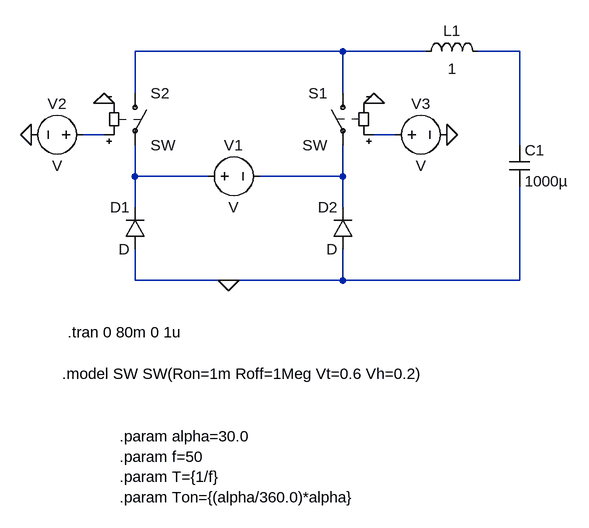
[diagram p0: schematic Draft2.asc]
Draft2.asc, the LTspice schematic file:
Version 4.1
SHEET 1 880 772
WIRE 176 64 -144 64
WIRE 304 64 176 64
WIRE 448 64 384 64
WIRE -144 128 -144 64
WIRE 176 128 176 64
WIRE -192 192 -224 192
WIRE 256 192 224 192
WIRE 448 208 448 64
WIRE -144 256 -144 208
WIRE -32 256 -144 256
WIRE 176 256 176 208
WIRE 176 256 48 256
WIRE -144 304 -144 256
WIRE 176 304 176 256
WIRE -144 416 -144 368
WIRE 0 416 -144 416
WIRE 176 416 176 368
WIRE 176 416 0 416
WIRE 448 416 448 272
WIRE 448 416 176 416
FLAG 0 416 0
FLAG -192 144 0
FLAG 224 144 0
FLAG 336 192 0
FLAG -304 192 0
SYMBOL sw 176 112 M0
SYMATTR InstName S1
SYMBOL sw -144 112 R0
SYMATTR InstName S2
SYMBOL diode -128 368 R180
WINDOW 0 24 64 Left 2
WINDOW 3 24 0 Left 2
SYMATTR InstName D1
SYMBOL diode 192 368 R180
WINDOW 0 24 64 Left 2
WINDOW 3 24 0 Left 2
SYMATTR InstName D2
SYMBOL voltage -48 256 R270
WINDOW 0 32 56 VTop 2
WINDOW 3 -32 56 VBottom 2
SYMATTR InstName V1
SYMBOL ind 400 80 M270
WINDOW 0 32 56 VTop 2
WINDOW 3 5 56 VBottom 2
SYMATTR InstName L1
SYMATTR Value 1
SYMATTR SpiceLine Rser=1m
SYMBOL cap 432 208 R0
SYMATTR InstName C1
SYMATTR Value 1000µ
SYMBOL voltage -208 192 R90
WINDOW 0 -32 56 VBottom 2
WINDOW 3 32 56 VTop 2
SYMATTR InstName V2
SYMBOL voltage 240 192 R270
WINDOW 0 32 56 VTop 2
WINDOW 3 -32 56 VBottom 2
SYMATTR InstName V3
TEXT -256 560 Left 2 !.model SW SW(Ron=1m Roff=1Meg Vt=0.6 Vh=0.2)
TEXT -248 496 Left 2 !.tran 0 80m 0 1u
TEXT -168 656 Left 2 !.param alpha=30.0\n.param f=50\n.param T={1/f}\n.param Ton={(alpha/360.0)*alpha}

The netlist it stands for:
* Draft2.asc
S1 N001 N006 N004 0 SW
S2 N001 N005 N003 0 SW
D1 0 N005 D
D2 0 N006 D
V1 N005 N006 V
L1 N002 N001 1 Rser=1m
C1 N002 0 1000µ
V2 N003 0 V
V3 N004 0 V
.model D D
.lib standard.dio
.model SW SW(Ron=1m Roff=1Meg Vt=0.6 Vh=0.2)
.tran 0 80m 0 1u
.param alpha=30.0
.param f=50
.param T={1/f}
.param Ton={(alpha/360.0)*alpha}
.backanno
.end